# Altium project NexieControl rev.2.PrjPcb
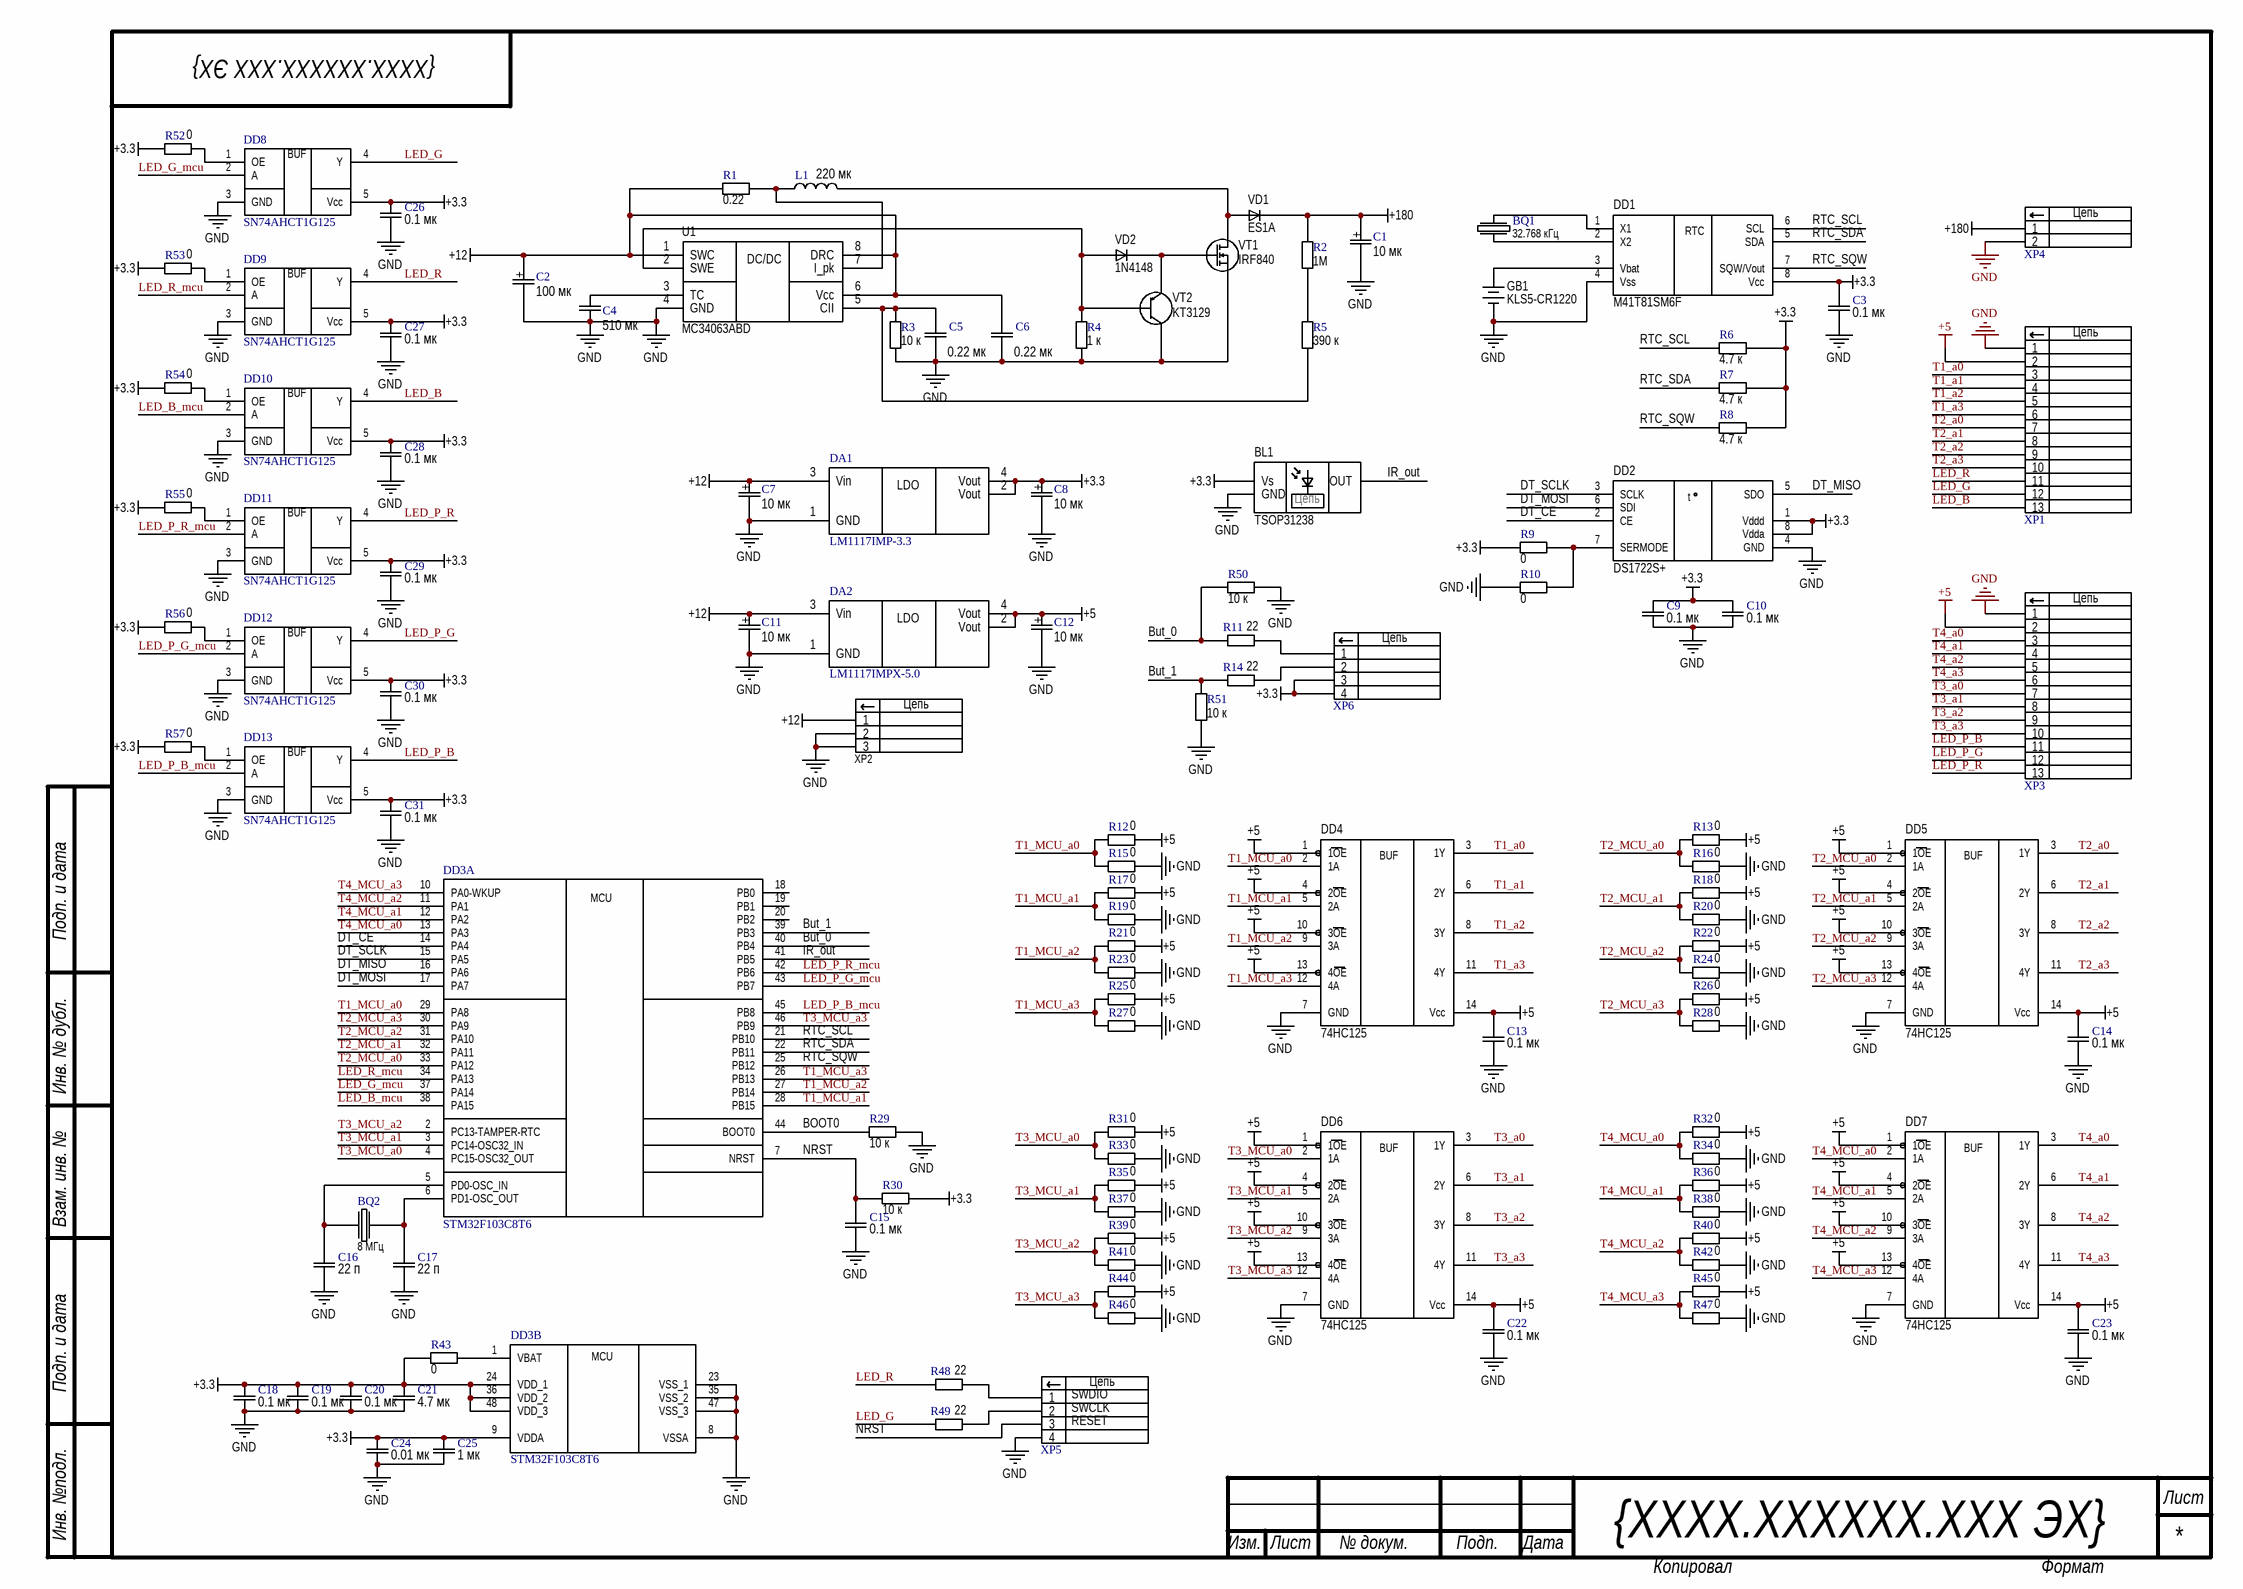
[diagram p0: NexieControl rev.2.SchDoc]
1 sheet, 119 parts. Net scope: global (net labels, ports and power ports of the same name join across sheets).
Board file: NexieControl rev.2.PcbDoc

## Sheet NexieControl rev.2.SchDoc
size 420 x 297 mm; ESKD_Naimenovanie_Izdeliya: {Наименование изделия}; ESKD_OboznachenieDokumenta: {ХХХХ.ХХХХХХ.ХХХ ЭХ}

### Parts
BL1  TSOP31238  [TSOP31238]
BQ1  Frequency: 32.768 кГц  [9HT10]  (hidden comment: 9HT10)
BQ2  Frequency: 8 МГц  [KX-9A]  (hidden comment: KX-9AT)
C1  value 10 мк  [K50-35(10x12)]  (hidden comment: Polar capacitor)
C2  value 100 мк  [Tantal_SMD_A]  (hidden comment: Polar capacitor)
C3  value 0.1 мк  [SMD_0603]  (hidden comment: Capacitors)
C4  value 510 мк  [SMD_0603]  (hidden comment: Capacitors)
C5  value 0.22 мк  [SMD_0603]  (hidden comment: Capacitors)
C6  value 0.22 мк  [SMD_0603]  (hidden comment: Capacitors)
C7  value 10 мк  [Tantal_SMD_C]  (hidden comment: Polar capacitor)
C8  value 10 мк  [Tantal_SMD_A]  (hidden comment: Polar capacitor)
C9  value 0.1 мк  [SMD_0603]  (hidden comment: Capacitors)
C10  value 0.1 мк  [SMD_0603]  (hidden comment: Capacitors)
C11  value 10 мк  [Tantal_SMD_C]  (hidden comment: Polar capacitor)
C12  value 10 мк  [Tantal_SMD_A]  (hidden comment: Polar capacitor)
C13  value 0.1 мк  [SMD_0603]  (hidden comment: Capacitors)
C14  value 0.1 мк  [SMD_0603]  (hidden comment: Capacitors)
C15  value 0.1 мк  [SMD_0603]  (hidden comment: Capacitors)
C16  value 22 п  [SMD_0603]  (hidden comment: Capacitors)
C17  value 22 п  [SMD_0603]  (hidden comment: Capacitors)
C18  value 0.1 мк  [SMD_0603]  (hidden comment: Capacitors)
C19  value 0.1 мк  [SMD_0603]  (hidden comment: Capacitors)
C20  value 0.1 мк  [SMD_0603]  (hidden comment: Capacitors)
C21  value 4.7 мк  [SMD_0603]  (hidden comment: Capacitors)
C22  value 0.1 мк  [SMD_0603]  (hidden comment: Capacitors)
C23  value 0.1 мк  [SMD_0603]  (hidden comment: Capacitors)
C24  value 0.01 мк  [SMD_0603]  (hidden comment: Capacitors)
C25  value 1 мк  [SMD_0603]  (hidden comment: Capacitors)
C26  value 0.1 мк  [SMD_0603]  (hidden comment: Capacitors)
C27  value 0.1 мк  [SMD_0603]  (hidden comment: Capacitors)
C28  value 0.1 мк  [SMD_0603]  (hidden comment: Capacitors)
C29  value 0.1 мк  [SMD_0603]  (hidden comment: Capacitors)
C30  value 0.1 мк  [SMD_0603]  (hidden comment: Capacitors)
C31  value 0.1 мк  [SMD_0603]  (hidden comment: Capacitors)
DA1  LM1117IMP-3.3  [S-PQFP-G64]
DA2  LM1117IMPX-5.0  [S-PQFP-G64]
DD1  M41T81SM6F  [Soic-8]
DD2  DS1722S+  [Soic-8]
DD3  STM32F103C8T6  [STM-LQFP48L]  (parts A,B of 2)
DD4  74HC125  [Soic-14]
DD5  74HC125  [Soic-14]
DD6  74HC125  [Soic-14]
DD7  74HC125  [Soic-14]
DD8  SN74AHCT1G125  [SOT 23]
DD9  SN74AHCT1G125  [SOT 23]
DD10  SN74AHCT1G125  [SOT 23]
DD11  SN74AHCT1G125  [SOT 23]
DD12  SN74AHCT1G125  [SOT 23]
DD13  SN74AHCT1G125  [SOT 23]
GB1  KLS5-CR1220  [KLS5-CR1220-01]
L1  value 220 мк  [2220]  (hidden comment: Inductor)
R1  value 0.22  [SMD_2512]  (hidden comment: Resistor)
R2  value 1М  [SMD_0805]  (hidden comment: Resistor)
R3  value 10 к  [SMD_0603]  (hidden comment: Resistor)
R4  value 1 к  [SMD_0603]  (hidden comment: Resistor)
R5  value 390 к  [SMD_0805]  (hidden comment: Resistor)
R6  value 4.7 к  [SMD_0603]  (hidden comment: Resistor)
R7  value 4.7 к  [SMD_0603]  (hidden comment: Resistor)
R8  value 4.7 к  [SMD_0603]  (hidden comment: Resistor)
R9  value 0  [SMD_0603]  (hidden comment: Resistor)
R10  value 0  [SMD_0603]  (hidden comment: Resistor)
R11  value 22  [SMD_0603]  (hidden comment: Resistor)
R12  value 0  [SMD_0603]  (hidden comment: Resistor)
R13  value 0  [SMD_0603]  (hidden comment: Resistor)
R14  value 22  [SMD_0603]  (hidden comment: Resistor)
R15  value 0  [SMD_0603]  (hidden comment: Resistor)
R16  value 0  [SMD_0603]  (hidden comment: Resistor)
R17  value 0  [SMD_0603]  (hidden comment: Resistor)
R18  value 0  [SMD_0603]  (hidden comment: Resistor)
R19  value 0  [SMD_0603]  (hidden comment: Resistor)
R20  value 0  [SMD_0603]  (hidden comment: Resistor)
R21  value 0  [SMD_0603]  (hidden comment: Resistor)
R22  value 0  [SMD_0603]  (hidden comment: Resistor)
R23  value 0  [SMD_0603]  (hidden comment: Resistor)
R24  value 0  [SMD_0603]  (hidden comment: Resistor)
R25  value 0  [SMD_0603]  (hidden comment: Resistor)
R26  value 0  [SMD_0603]  (hidden comment: Resistor)
R27  value 0  [SMD_0603]  (hidden comment: Resistor)
R28  value 0  [SMD_0603]  (hidden comment: Resistor)
R29  value 10 к  [SMD_0603]  (hidden comment: Resistor)
R30  value 10 к  [SMD_0603]  (hidden comment: Resistor)
R31  value 0  [SMD_0603]  (hidden comment: Resistor)
R32  value 0  [SMD_0603]  (hidden comment: Resistor)
R33  value 0  [SMD_0603]  (hidden comment: Resistor)
R34  value 0  [SMD_0603]  (hidden comment: Resistor)
R35  value 0  [SMD_0603]  (hidden comment: Resistor)
R36  value 0  [SMD_0603]  (hidden comment: Resistor)
R37  value 0  [SMD_0603]  (hidden comment: Resistor)
R38  value 0  [SMD_0603]  (hidden comment: Resistor)
R39  value 0  [SMD_0603]  (hidden comment: Resistor)
R40  value 0  [SMD_0603]  (hidden comment: Resistor)
R41  value 0  [SMD_0603]  (hidden comment: Resistor)
R42  value 0  [SMD_0603]  (hidden comment: Resistor)
R43  value 0  [SMD_0603]  (hidden comment: Resistor)
R44  value 0  [SMD_0603]  (hidden comment: Resistor)
R45  value 0  [SMD_0603]  (hidden comment: Resistor)
R46  value 0  [SMD_0603]  (hidden comment: Resistor)
R47  value 0  [SMD_0603]  (hidden comment: Resistor)
R48  value 22  [SMD_0603]  (hidden comment: Resistor)
R49  value 22  [SMD_0603]  (hidden comment: Resistor)
R50  value 10 к  [SMD_0603]  (hidden comment: Resistor)
R51  value 10 к  [SMD_0603]  (hidden comment: Resistor)
R52  value 0  [SMD_0603]  (hidden comment: Resistor)
R53  value 0  [SMD_0603]  (hidden comment: Resistor)
R54  value 0  [SMD_0603]  (hidden comment: Resistor)
R55  value 0  [SMD_0603]  (hidden comment: Resistor)
R56  value 0  [SMD_0603]  (hidden comment: Resistor)
R57  value 0  [SMD_0603]  (hidden comment: Resistor)
U1  MC34063ABD  [SO-8]
VD1  ES1A  [DO_214AC]
VD2  1N4148  [SOD-323]
VT1  IRF840  [D2_PAK]
VT2  KT3129  [SOT-23]
XP1  DS1021-1*13SF11  [DS1021-1*13]  (value not drawn)
XP2  Power_jack  [DC_Power_Jack]  (value not drawn)
XP3  DS1021-1*13SF11  [DS1021-1*13]  (value not drawn)
XP4  DS1021-1*2SF11  [DS1021-1*2]  (value not drawn)
XP5  DS1021-1*4SF11  [DS1021-1*4]  (value not drawn)
XP6  DS1021-1*4SF11  [DS1021-1*4]  (value not drawn)

### Nets
+3.3: BL1.2(Vs) C3.2 C8.1 C9.2 C10.2 C18.2 C19.2 C20.2 C21.2 C24.2 C25.2 C26.2 C27.2 C28.2 C29.2 C30.2 C31.2 DA1.2(Vout) DA1.4(Vout) DD1.8(Vcc) DD2.1(Vddd) DD2.8(Vdda) DD3.9(VDDA) DD3.24(VDD_1) DD3.36(VDD_2) DD3.48(VDD_3) DD8.5(Vcc) DD9.5(Vcc) DD10.5(Vcc) DD11.5(Vcc) DD12.5(Vcc) DD13.5(Vcc) R6.1 R7.1 R8.1 R9.1 R30.1 R43.1 R52.1 R53.1 R54.1 R55.1 R56.1 R57.1 XP6.3 XP6.4
+5: C12.1 C13.2 C14.2 C22.2 C23.2 DA2.2(Vout) DA2.4(Vout) DD4.1(1OE) DD4.4(2OE) DD4.10(3OE) DD4.13(4OE) DD4.14(Vcc) DD5.1(1OE) DD5.4(2OE) DD5.10(3OE) DD5.13(4OE) DD5.14(Vcc) DD6.1(1OE) DD6.4(2OE) DD6.10(3OE) DD6.13(4OE) DD6.14(Vcc) DD7.1(1OE) DD7.4(2OE) DD7.10(3OE) DD7.13(4OE) DD7.14(Vcc) R12.2 R13.2 R17.2 R18.2 R21.2 R22.2 R25.2 R26.2 R31.2 R32.2 R35.2 R36.2 R39.2 R40.2 R44.2 R45.2 XP1.2 XP3.2
+12: C2.1 C6.2 C7.1 C11.1 DA1.3(Vin) DA2.3(Vin) R1.1 U1.1(SWC) U1.6(Vcc) U1.8(DRC) XP2.1
+180: C1.1 R2.2 VD1.2(K) XP4.1
GND: BL1.1(GND) C1.2 C2.2 C3.1 C4.1 C5.1 C6.1 C7.2 C8.2 C9.1 C10.1 C11.2 C12.2 C13.1 C14.1 C15.1 C16.1 C17.1 C18.1 C19.1 C20.1 C21.1 C22.1 C23.1 C24.1 C25.1 C26.1 C27.1 C28.1 C29.1 C30.1 C31.1 DA1.1(GND) DA2.1(GND) DD1.4(Vss) DD2.4(GND) DD3.8(VSSA) DD3.23(VSS_1) DD3.35(VSS_2) DD3.47(VSS_3) DD4.7(GND) DD5.7(GND) DD6.7(GND) DD7.7(GND) DD8.3(GND) DD9.3(GND) DD10.3(GND) DD11.3(GND) DD12.3(GND) DD13.3(GND) GB1.2(-) R3.1 R4.1 R10.2 R15.1 R16.1 R19.1 R20.1 R23.1 R24.1 R27.1 R28.1 R29.2 R33.1 R34.1 R37.1 R38.1 R41.1 R42.1 R46.1 R47.1 R50.2 R51.1 U1.4(GND) VT1.3(S) VT2.1(К) XP1.1 XP2.2 XP2.3 XP3.1 XP4.2 XP5.4
BOOT0: DD3.44(BOOT0) R29.1
But_0: DD3.40(PB4) R11.2 R50.1
But_1: DD3.39(PB3) R14.2 R51.2
DT_CE: DD2.2(CE) DD3.14(PA4)
DT_MISO: DD2.5(SDO) DD3.16(PA6)
DT_MOSI: DD2.6(SDI) DD3.17(PA7)
DT_SCLK: DD2.3(SCLK) DD3.15(PA5)
IR_out: BL1.3(OUT) DD3.41(PB5)
LED_B: DD10.4(Y) XP1.13
LED_B_mcu: DD3.38(PA15) DD10.2(A)
LED_G: DD8.4(Y) R49.2 XP1.12
LED_G_mcu: DD3.37(PA14) DD8.2(A)
LED_P_B: DD13.4(Y) XP3.11
LED_P_B_mcu: DD3.45(PB8) DD13.2(A)
LED_P_G: DD12.4(Y) XP3.12
LED_P_G_mcu: DD3.43(PB7) DD12.2(A)
LED_P_R: DD11.4(Y) XP3.13
LED_P_R_mcu: DD3.42(PB6) DD11.2(A)
LED_R: DD9.4(Y) R48.2 XP1.11
LED_R_mcu: DD3.34(PA13) DD9.2(A)
NRST: C15.2 DD3.7(NRST) R30.2 XP5.3
RTC_SCL: DD1.6(SCL) DD3.21(PB10) R6.2
RTC_SDA: DD1.5(SDA) DD3.22(PB11) R7.2
RTC_SQW: DD1.7(SQW/Vout) DD3.25(PB12) R8.2
T1_a0: DD4.3(1Y) XP1.3
T1_a1: DD4.6(2Y) XP1.4
T1_a2: DD4.8(3Y) XP1.5
T1_a3: DD4.11(4Y) XP1.6
T1_MCU_a0: DD3.29(PA8) DD4.2(1A) R12.1 R15.2
T1_MCU_a1: DD3.28(PB15) DD4.5(2A) R17.1 R19.2
T1_MCU_a2: DD3.27(PB14) DD4.9(3A) R21.1 R23.2
T1_MCU_a3: DD3.26(PB13) DD4.12(4A) R25.1 R27.2
T2_a0: DD5.3(1Y) XP1.7
T2_a1: DD5.6(2Y) XP1.8
T2_a2: DD5.8(3Y) XP1.9
T2_a3: DD5.11(4Y) XP1.10
T2_MCU_a0: DD3.33(PA12) DD5.2(1A) R13.1 R16.2
T2_MCU_a1: DD3.32(PA11) DD5.5(2A) R18.1 R20.2
T2_MCU_a2: DD3.31(PA10) DD5.9(3A) R22.1 R24.2
T2_MCU_a3: DD3.30(PA9) DD5.12(4A) R26.1 R28.2
T3_a0: DD6.3(1Y) XP3.7
T3_a1: DD6.6(2Y) XP3.8
T3_a2: DD6.8(3Y) XP3.9
T3_a3: DD6.11(4Y) XP3.10
T3_MCU_a0: DD3.4(PC15-OSC32_OUT) DD6.2(1A) R31.1 R33.2
T3_MCU_a1: DD3.3(PC14-OSC32_IN) DD6.5(2A) R35.1 R37.2
T3_MCU_a2: DD3.2(PC13-TAMPER-RTC) DD6.9(3A) R39.1 R41.2
T3_MCU_a3: DD3.46(PB9) DD6.12(4A) R44.1 R46.2
T4_a0: DD7.3(1Y) XP3.3
T4_a1: DD7.6(2Y) XP3.4
T4_a2: DD7.8(3Y) XP3.5
T4_a3: DD7.11(4Y) XP3.6
T4_MCU_a0: DD3.13(PA3) DD7.2(1A) R32.1 R34.2
T4_MCU_a1: DD3.12(PA2) DD7.5(2A) R36.1 R38.2
T4_MCU_a2: DD3.11(PA1) DD7.9(3A) R40.1 R42.2
T4_MCU_a3: DD3.10(PA0-WKUP) DD7.12(4A) R45.1 R47.2
NetBQ1_1: BQ1.1 DD1.2(X2)
NetBQ1_2: BQ1.2 DD1.1(X1)
NetBQ2_1: BQ2.1 C17.2 DD3.6(PD1-OSC_OUT)
NetBQ2_3: BQ2.3 C16.2 DD3.5(PD0-OSC_IN)
NetC4_2: C4.2 U1.3(TC)
NetC5_2: C5.2 R3.2 R5.1 U1.5(CII)
NetDD1_3: DD1.3(Vbat) GB1.1(+)
NetDD2_7: DD2.7(SERMODE) R9.2 R10.1
NetDD3_1: DD3.1(VBAT) R43.2
NetDD8_1: DD8.1(OE) R52.2
NetDD9_1: DD9.1(OE) R53.2
NetDD10_1: DD10.1(OE) R54.2
NetDD11_1: DD11.1(OE) R55.2
NetDD12_1: DD12.1(OE) R56.2
NetDD13_1: DD13.1(OE) R57.2
NetL1_1: L1.1 R1.2 U1.7(I_pk)
NetL1_2: L1.2 VD1.1(A) VT1.2(D)
NetR2_1: R2.1 R5.2
NetR4_2: R4.2 U1.2(SWE) VD2.1(A) VT2.2(Б)
NetR11_1: R11.1 XP6.1
NetR14_1: R14.1 XP6.2
NetR48_1: R48.1 XP5.1
NetR49_1: R49.1 XP5.2
NetVD2_2: VD2.2(K) VT1.1(G) VT2.3(Э)

Not connected (* = marked no-connect by the designer): DD3 18(PB0) 19(PB1) 20(PB2)

### Notes on the sheet
- (near XP5) SWDIO
- (near XP5) SWCLK
- (near XP5) RESET
- Подп. и дата
- Инв. № дубл.
- Взам. инв. №
- Инв. №подл.
- Лист
- Изм.
- № докум.
- Подп.
- Дата
- Копировал
- Формат
- (in symbol 74HC125) BUF
- (in symbol DS1021-1*2SF11) Цепь
- (in symbol DS1021-1*4SF11) Цепь
- (in symbol DS1021-1*13SF11) Цепь
- (in symbol DS1722S+) t
- (in symbol MC34063ABD) DC/DC
- (in symbol Polar capacitor) +
- (in symbol Power_jack) Цепь
- (in symbol STM32F103C8T6, part A) MCU
- (in symbol STM32F103C8T6, part B) MCU
- (in symbol TSOP31238) Цепь

### Library data of the parts
BL1 = TSOP31238: TSOP31238 (TSOP1738), ИК-приемник 38кГц; Manufacturer: Vishay; Class: IR Receiver; ESKD: TSOP31238; Creator: FedorenkoSS
BQ1 = 9HT10: CRYSTAL, 32.768KHZ, 12.5PF, 3.2 X 1.5MM;; CRYSTAL, 32.768KHZ, 12.5PF, 3.2 X 1.5MM; Frequency Nom:32.768kHz; Crystal Case:SMD, 3.2mm x 1.5mm; Frequency Stability + / -:-; Load Capacitance:12.5pF; Frequency Tolerance + / -:20ppm; Product Range:9HT10 Series; Frequency:32.768kHz; Manufacturer: TXC Corporation; ESKD: 9HT10-32.768KDZF-T; Type: 9HT10; Creator: FedorenkoSS
BQ2 = KX-9AT: Manufacturer: Geyer Electronic; ESKD: KX-9AT (12.89048); Creator: PavelR; Type: KX-9AT
C1 = Polar capacitor: ESKD: RD2E106M1012M; Manufacturer: *; Creator: PavelR
C2 = Polar capacitor: Manufacturer: Vishay; ESKD: 293D107X9020D2TE3; Creator: PavelR
DA1 = LM1117IMP-3.3/NOPB: Стабилизатор напряжения LowDrop, +3.3В, 0.8А [SOT-223]; Manufacturer: Texas Instruments; Class: LDO; ESKD: LM1117IMP-3.3/NOPB; Package: SOT-223; Creator: FedorenkoS
DA2 = LM1117IMPX-5.0: Линейный регулятор с низким падением напряжения, 5В, 1.2А, [SOT-223]; Manufacturer: Texas Instruments; ESKD: LM1117IMPX-5.0/NOPB; Class: LDO; Package: SOT-223; Creator: FedorenkoS
DD1 = M41T81SM6F: Часы реального времени, формат (дата/месяц/год сс:мм:чч), I2C, 2.7В...5.5В, [SOIC-8]; Manufacturer: ST Microelectronics; Class: RTC; ESKD: M41T81SM6F; Creator: FedorenkoSS
DD2 = DS1722S+: DS1722 / Digital Thermometer with / SPI/3-Wire Interface; Manufacturer: Dallas_Semiconductor; ESKD: DS1722S+; Creator: FedorenkoSS; Class: DIGITAL THERMOMETER
DD3 = STM32F103C8T6: Manufacturer: STMicroelectronix; ESKD: MC-ARM-STM32F103X8_B-SQ48; Class: Microcontroller; Package: LQFP48L
DD4-DD7 = 74HC125: 74HC125D.653, Буферы и линейные аппаратные драйверы QUAD 3-STATE BUS BUF [SO-14]; Manufacturer: NXP Semiconductor; Class: Buffer; ESKD: 74HC125D.653; Creator: FedorenkoSS
DD8-DD13 = SN74AHCT1G125: Manufacturer: Texas Instruments; ESKD: SN74AHCT1G125DBVR; Class: BUF; Package: SOT-23
GB1 = KLS5-CR1220: KLS5-CR1220-01 (FC1-5010), Батарейный отсек 1xCR1220; Manufacturer: KLS electronic co ltd; Class: Battery; ESKD: L-KLS5-CR1220-01; Creator: FedorenkoSS
L1 = Inductor: ESKD: LQH55DN221M; Creater: FedorenkoS; Manufacturer: *
R1 = Resistor: Manufacturer: Yageo; ESKD: RL2512JK-070R22L; Creator: PavelR
U1 = MC34063ABD: Manufacturer: ST Microelectronics; ESKD: MC34063ABD-TR; Class: DC-DC
VD1 = ES1A: ES1J, Диод быстродействующий 1А 600В 35нс [SMA / DO-214AC]; Manufacturer: DC COMPONENTS CO., LTD.; Class: Diode; ESKD: ES1A; Package: DO-214AC; Creator: FedorenkoSS
VD2 = 1N4148: Manufacturer: Vishay; Class: Diode; ESKD: 1N4148WS; Package: SOD-323; Creator: FedorenkoSS
VT1 = IRF840ASPBF: Транзистор, N-канал 500В 8.0А; Manufacturer: Vishay; Class: Transistor; ESKD: IRF840ASPBF; Creator: FedorenkoS
VT2 = KT3129: Manufacturer: Россия; ESKD: КТ3129Б9; Class: Transistors; Analog: ВС857А; Creator: FedorenkoS
XP1 XP3 = DS1021-1*13SF11: PLS; Производитель: Connfly; Разработчик библиотеки: Федоренко С.С.; ЕСКД: DS1021-1*13SF11
XP4 = DS1021-1*2SF11: PLS; Производитель: Connfly; Разработчик библиотеки: Федоренко С.С.; ЕСКД: DS1021-1*2SF11
XP5 XP6 = DS1021-1*4SF11: PLS; Производитель: Connfly; Разработчик библиотеки: Федоренко С.С.; ЕСКД: DS1021-1*4SF11
C3-C6 C9 C10 C13-C31 = Capacitors: ESKD: *; Manufacturer: *; Creator: PavelR
C7 C8 C11 C12 = Polar capacitor: ESKD: *; Manufacturer: *; Creator: PavelR
R2-R57 = Resistor: Manufacturer: *; ESKD: *; Creator: PavelR